# Altium schematic sheet LFO Schematic Sheet.2.SchDoc: LFO Syntheziser
size A4; Author: Ruben Boeve; CompanyName: Windesheim; DrawnBy: Ruben Boeve; Engineer: Ruben Boeve; SheetNumber: 1; SheetTotal: 1
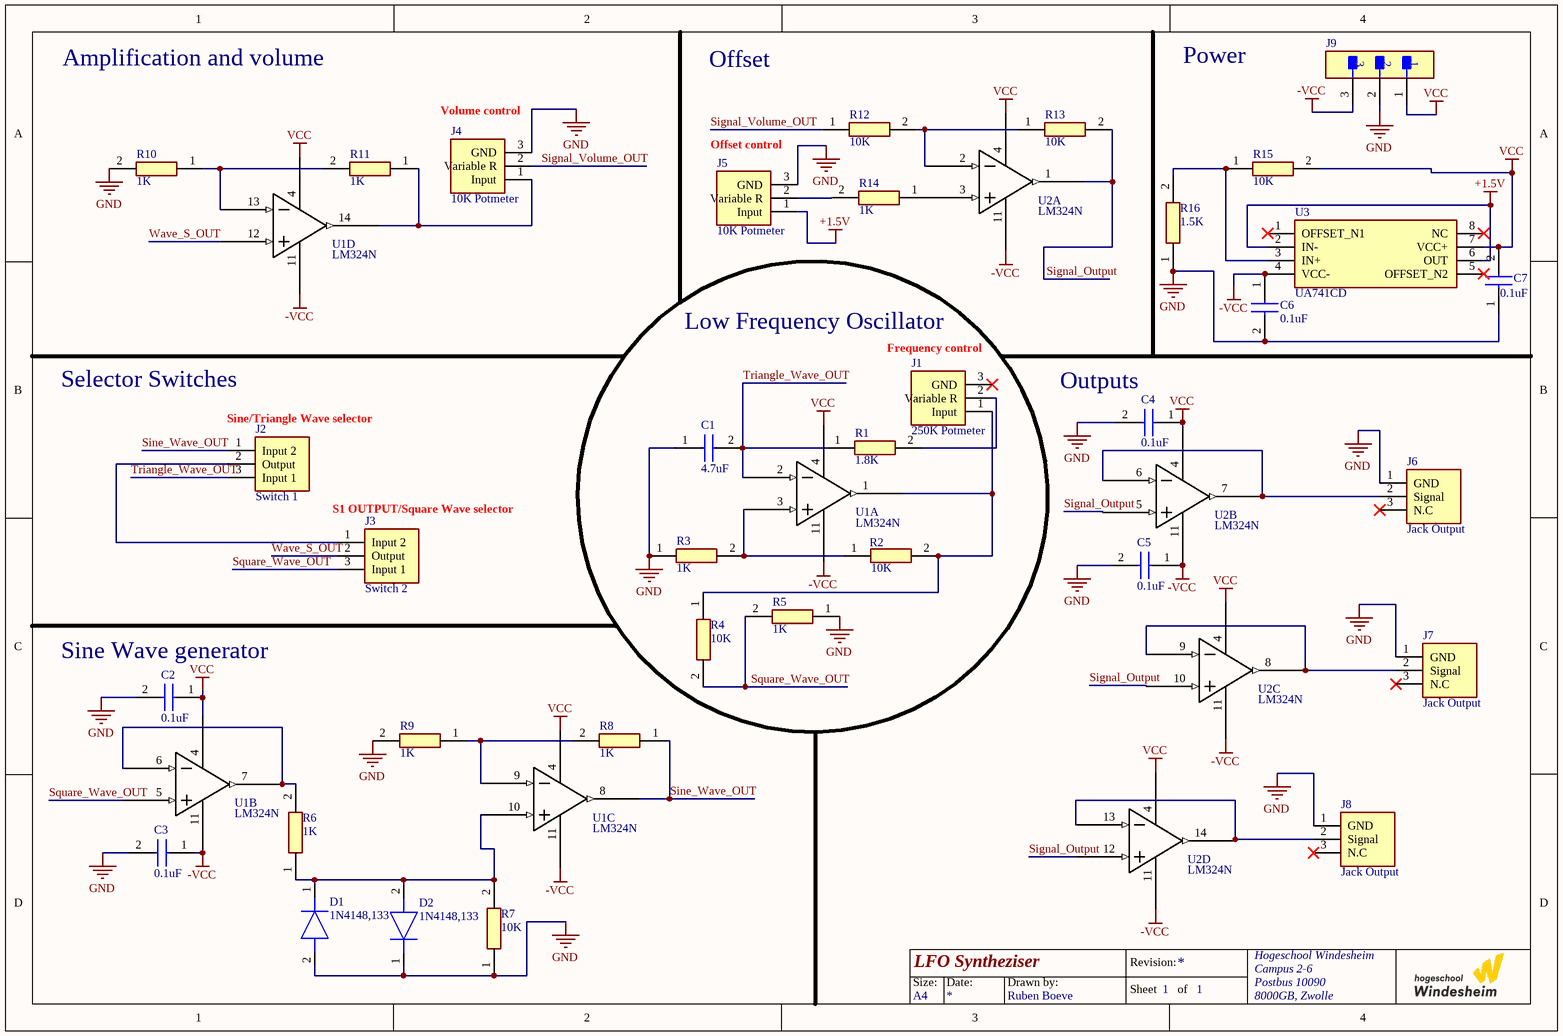
[diagram p0: LFO Schematic Sheet.2.SchDoc]

## Parts
C1  4.7uF  [CAPC3216X180N]
C2  0.1uF  [C1206]
C3  0.1uF  [C1206]
C4  0.1uF  [C1206]
C5  0.1uF  [C1206]
C6  0.1uF  [C1206]
C7  0.1uF  [C1206]
D1  1N4148,133  [DIOAD1165W56L425D185]
D2  1N4148,133  [DIOAD1165W56L425D185]
J1  250K Potmeter  [SHDR3W50P0X200_1X3_650X240X440P]
J2  Switch 1  [SHDR3W50P0X200_1X3_650X240X440P]
J3  Switch 2  [SHDR3W50P0X200_1X3_650X240X440P]
J4  10K Potmeter  [SHDR3W50P0X200_1X3_650X240X440P]
J5  10K Potmeter  [SHDR3W50P0X200_1X3_650X240X440P]
J6  Jack Output  [SHDR3W50P0X200_1X3_650X240X440P]
J7  Jack Output  [SHDR3W50P0X200_1X3_650X240X440P]
J8  Jack Output  [SHDR3W50P0X200_1X3_650X240X440P]
J9  B3B-XH-A(LF)(SN)  [FP-B3B-XH-A_LF_SN-MFG]  (value not drawn)
R1  1.8K  [ERJS08_U08_(1206)]
R2  10K  [RESC3116X65N]
R3  1K  [RCC1206_e3]
R4  10K  [RESC3116X65N]
R5  1K  [RCC1206_e3]
R6  1K  [RCC1206_e3]
R7  10K  [RESC3116X65N]
R8  1K  [RCC1206_e3]
R9  1K  [RCC1206_e3]
R10  1K  [RCC1206_e3]
R11  1K  [RCC1206_e3]
R12  10K  [RESC3116X65N]
R13  10K  [RESC3116X65N]
R14  1K  [RCC1206_e3]
R15  10K  [RESC3116X65N]
R16  1.5K  [RESC3246X60N]
U1  LM324N  [SOIC127P600X175-14N]  (parts A,B,C,D of 4)
U2  LM324N  [SOIC127P600X175-14N]  (parts A,B,C,D of 4)
U3  UA741CD  [SOIC127P600X175-8N]

## Nets
+1.5V: J5.1(Input) U3.2(IN-) U3.6(OUT)
-VCC: C3.1 C5.1 C6.1 J9.3 U1.11(GND) U2.11(GND) U3.4(VCC-)
GND: C1.1 C2.2 C3.2 C4.2 C5.2 C6.2 C7.1 D1.2(A) D2.1(K) J4.3(GND) J5.3(GND) J6.1(GND) J7.1(GND) J8.1(GND) J9.2 R3.1 R5.1 R7.1 R9.2 R10.2 R16.1
VCC: C2.1 C4.1 C7.2 J9.1 R15.2 U1.4(VCC) U2.4(VCC) U3.7(VCC+)
Signal_Output: R13.2 U2.1(Out) U2.5(+) U2.10(+) U2.12(+)
Signal_Volume_OUT: J4.2(Variable_R) R12.1
Sine_Wave_OUT: J2.1(Input_2) R8.1 U1.8(Out)
Square_Wave_OUT: J3.3(Input_1) R4.2 R5.2 U1.5(+)
Triangle_Wave_OUT: C1.2 J2.3(Input_1) R1.1 U1.2(-)
Wave_S_OUT: J3.2(Output) U1.12(+)
NetD1_1: D1.1(K) D2.2(A) R6.1 R7.2 U1.10(+)
NetJ1_1: J1.1(Input) R2.2 R4.1 U1.1(Out)
NetJ1_2: J1.2(Variable_R) R1.2
NetJ2_2: J2.2(Output) J3.1(Input_2)
NetJ4_1: J4.1(Input) R11.1 U1.14(Out)
NetJ5_2: J5.2(Variable_R) R14.2
NetJ6_2: J6.2(Signal) U2.6(-) U2.7(Out)
NetJ7_2: J7.2(Signal) U2.8(Out) U2.9(-)
NetJ8_2: J8.2(Signal) U2.13(-) U2.14(Out)
NetR2_1: R2.1 R3.2 U1.3(+)
NetR6_2: R6.2 U1.6(-) U1.7(Out)
NetR8_2: R8.2 R9.1 U1.9(-)
NetR10_1: R10.1 R11.2 U1.13(-)
NetR12_2: R12.2 R13.1 U2.2(-)
NetR14_1: R14.1 U2.3(+)
NetR15_1: R15.1 R16.2 U3.3(IN+)

Not connected (* = marked no-connect by the designer): J1 3(GND)*; J6 3(N.C)*; J7 3(N.C)*; J8 3(N.C)*; U3 1(OFFSET_N1)* 5(OFFSET_N2)* 8(NC)*

## Notes on the sheet
- Amplification and volume
- (near J4) Volume control
- Offset
- Power
- (near J5) Offset control
- (near J1) Low Frequency Oscillator
- (near J1) Frequency control
- Selector Switches
- (near J2) Sine/Triangle Wave selector
- (near C4) Outputs
- (near J3) S1 OUTPUT/Square Wave selector
- (near C2) Sine Wave generator
- Size:
- Date:
- Drawn by:
- Revision:
- Hogeschool Windesheim
- Campus 2-6
- Postbus 10090
- A4
- Sheet
- of
- 8000GB, Zwolle

## Library data of the parts
C1 = KGM31AR71H475KU: Capacitor; Manufacturer_Name: Kyocera AVX; Datasheet Link: https://eu.mouser.com/datasheet/2/40/KGM_X7R-3223212.pdf; Height: 1.8mm; Manufacturer_Part_Number: KGM31AR71H475KU; Mouser Part Number: 581-KGM31AR71H475KU; Mouser Price/Stock: https://www.mouser.co.uk/ProductDetail/KYOCERA-AVX/KGM31AR71H475KU?qs=9vOqFld9vZWqrEB01UnVcA%3D%3D; Arrow Part Number: KGM31AR71H475KU; Arrow Price/Stock: https://www.arrow.com/en/products/kgm31ar71h475ku/avx?region=europe
C2-C7 = C1206F104M4RACTU: Capacitor; Manufacturer_Name: KEMET; Datasheet Link: https://content.kemet.com/datasheets/KEM_C1012_X7R_OPENMODE_SMD.pdf; Manufacturer_Part_Number: C1206F104M4RACTU; Mouser Part Number: 80-C1206F104M4R; Mouser Price/Stock: https://www.mouser.com/Search/Refine.aspx?Keyword=80-C1206F104M4R
D1 D2 = 1N4148,133: Diode; Manufacturer_Name: Nexperia; Datasheet Link: https://assets.nexperia.com/documents/data-sheet/1N4148_1N4448.pdf; Manufacturer_Part_Number: 1N4148,133; Mouser Part Number: 771-1N4148,133; Mouser Price/Stock: https://www.mouser.co.uk/ProductDetail/Nexperia/1N4148133?qs=elmhQ6eFu7hy8ApvpFxPZg%3D%3D; Arrow Part Number: 1N4148,133; Arrow Price/Stock: https://www.arrow.com/en/products/1n4148133/nxp-semiconductors
J1-J8 = M22-7130342: Connector; Manufacturer_Name: Harwin; Datasheet Link: https://cdn.harwin.com/pdfs/M22-713.pdf; Height: 4.4mm; Manufacturer_Part_Number: M22-7130342; Mouser Part Number: 855-M22-7130342; Mouser Price/Stock: https://www.mouser.co.uk/ProductDetail/Harwin/M22-7130342?qs=ulE8k0yEMYayWQDoDALDQw%3D%3D
J9 = CMP-17439-000014-3: CONN HEADER VERT 3POS 2.5MM; Max Voltage Rating (DC): 250V; Number of Positions: 3; Current Rating: 3A; Gender: Male; Wire/Cable Gauge: 22AWG; Contact Resistance: 20mR; Insulation Resistance: 1GR; Insulation Material: Nylon; Contact Plating: Tin; Depth: 5.75mm; Contact Type: Male Pin; Max Operating Temperature: 85°C; Insulation Color: Natural; Voltage Rating (AC): 250V; Color: Natural; Connector Type: Header; Orientation: Straight; Fastening Type: Detent; Housing Color: White; Min Operating Temperature: -25°C; Termination: Solder; Voltage Rating: 250V; Series: XH; Pitch: 2.5mm; Contact Shape: Square; Number of Rows: 1; Lead Free: Lead Free; Packaging: Bulk; Mount: Through Hole; Flammability Rating: UL94 V-0; Max Voltage Rating (AC): 250V; REACH SVHC: No SVHC; Housing Material: Polyamide; Contact Material: Brass; Lead Pitch: 2.5mm; Contact Finish - Mating: TIN; Length: 9.9mm; Max Current Rating: 3A; Number of Contacts: 3
R1 = ERJ-S08F1101V: Moet 1.8K zijn; Manufacturer_Name: Panasonic; Datasheet Link: http://industrial.panasonic.com/cdbs/www-data/pdf/RDP0000/AOA0000C334.pdf; Height: 0.7mm; Manufacturer_Part_Number: ERJ-S08F1101V
R2 R4 R7 R12 R13 R15 = RC1206FR-0710KL: Resistor 1206; Manufacturer_Name: YAGEO; Datasheet Link: https://www.yageo.com/upload/media/product/app/datasheet/rchip/pyu-rc_group_51_rohs_l.pdf; Height: 0.65mm; Manufacturer_Part_Number: RC1206FR-0710KL; Mouser Part Number: 603-RC1206FR-0710KL; Mouser Price/Stock: https://www.mouser.co.uk/ProductDetail/YAGEO/RC1206FR-0710KL?qs=%252BhB4WxZmbVEJV82xdVgRUw%3D%3D; Arrow Part Number: RC1206FR-0710KL; Arrow Price/Stock: https://www.arrow.com/en/products/rc1206fr-0710kl/yageo?region=europe
R3 R5 R6 R8-R11 R14 = RCC12061K00FKEA: Resistor; Manufacturer_Name: Vishay; Datasheet Link: https://www.vishay.com/docs/20066/rcce3.pdf; Height: 0.6mm; Manufacturer_Part_Number: RCC12061K00FKEA; Mouser Part Number: 71-RCC12061K00FKEA; Mouser Price/Stock: https://www.mouser.co.uk/ProductDetail/Vishay-Dale/RCC12061K00FKEA?qs=IS%252B4QmGtzzoI2b9zl4DztQ%3D%3D; Arrow Part Number: RCC12061K00FKEA; Arrow Price/Stock: https://www.arrow.com/en/products/rcc12061k00fkea/vishay?utm_currency=USD&region=nac
R16 = CRCW12181K50JNEK: Resistor; Manufacturer_Name: Vishay; Datasheet Link: https://www.vishay.com/docs/20035/dcrcwe3.pdf; Height: 0.6mm; Manufacturer_Part_Number: CRCW12181K50JNEK
U1 U2 = LM324N: Quad Op-Amp; Manufacturer_Name: Texas Instruments; Manufacturer_Part_Number: LM324M/NOPB; ComponentLink1Description: New link; ComponentLink1URL: http://www.ti.com/lit/ds/symlink/lm324-n.pdf; Height: 1.75mm; Mouser Part Number: 926-LM324M/NOPB
U3 = UA741CD: Integrated Circuit; Manufacturer_Name: Texas Instruments; Datasheet Link: http://www.ti.com/lit/ds/symlink/ua741.pdf; Height: 1.75mm; Manufacturer_Part_Number: UA741CD; Mouser Part Number: 595-UA741CD; Mouser Price/Stock: https://www.mouser.co.uk/ProductDetail/Texas-Instruments/UA741CD?qs=WzgTT80quPFAtpKavrxmtQ%3D%3D; Arrow Part Number: UA741CD; Arrow Price/Stock: https://www.arrow.com/en/products/ua741cd/texas-instruments?utm_currency=USD&region=nac